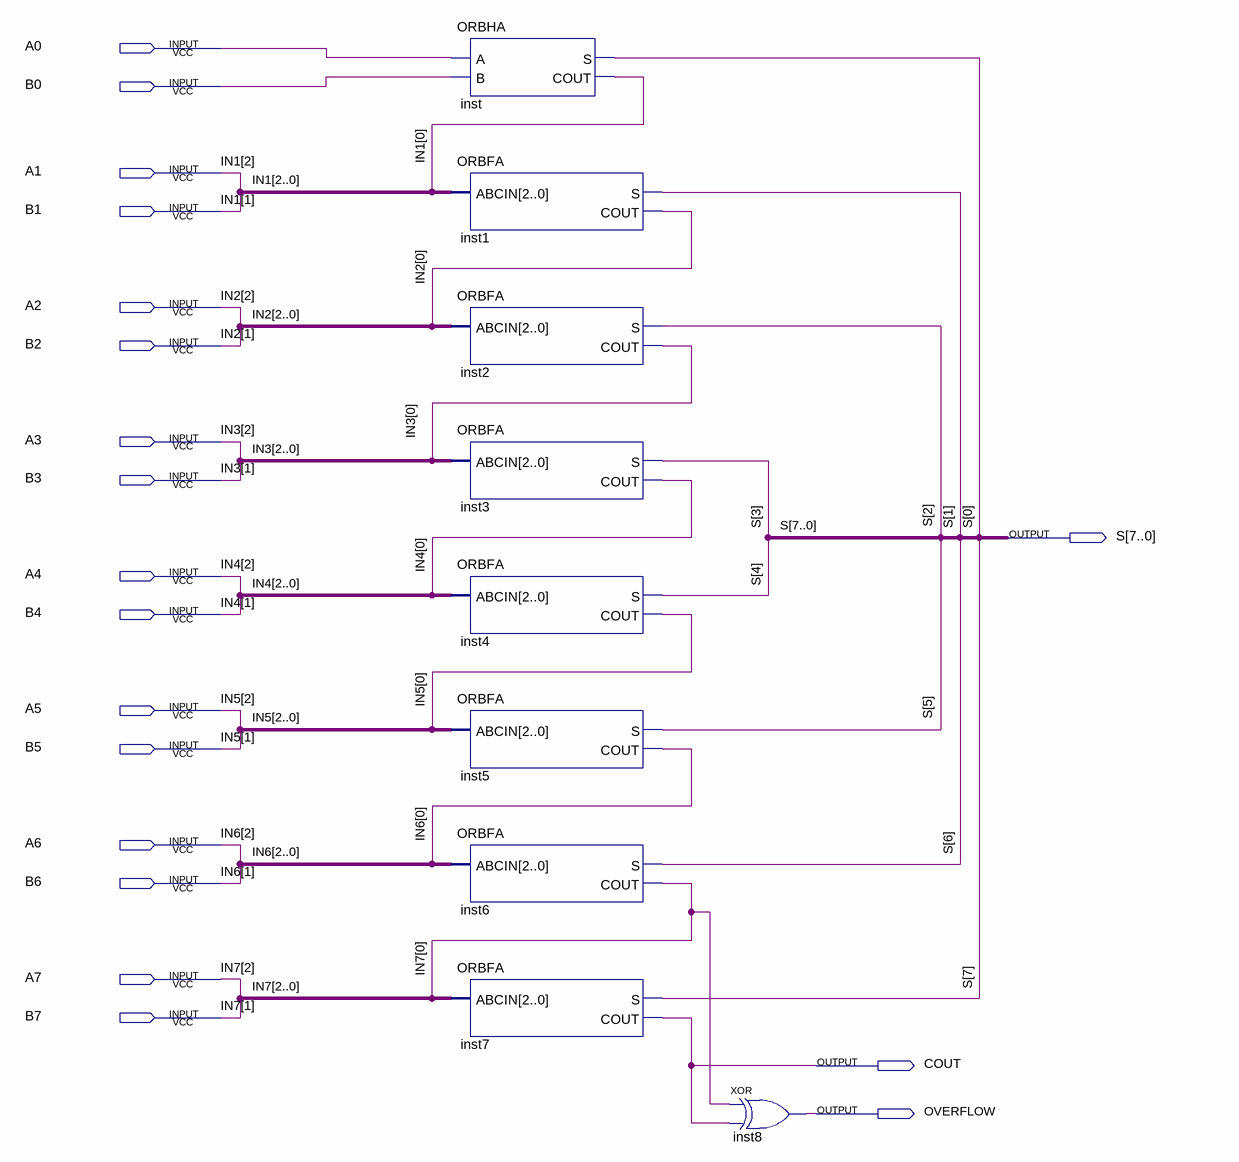
[diagram p0: schematic sheet]
// Quartus schematic ORBRCA8.bdf as structural Verilog: 9 symbols, 19 pins
module ORBRCA8 (
  input  A0,
  input  B0,
  input  A1,
  input  B1,
  input  A2,
  input  B2,
  input  A3,
  input  B3,
  input  A4,
  input  B4,
  input  A5,
  input  B5,
  input  A6,
  input  B6,
  input  A7,
  input  B7,
  output [7:0] S,
  output COUT,
  output OVERFLOW
);

  wire [0:0] IN1, IN2, IN3, IN4, IN5, IN6, IN7;

  ORBHA inst (.A(A0), .B(B0), .S(S[0]), .COUT(IN1[0]));
  ORBFA inst1 (.ABCIN({A1, B1, IN1[0]}), .S(S[1]), .COUT(IN2[0]));
  ORBFA inst2 (.ABCIN({A2, B2, IN2[0]}), .S(S[2]), .COUT(IN3[0]));
  ORBFA inst3 (.ABCIN({A3, B3, IN3[0]}), .S(S[3]), .COUT(IN4[0]));
  ORBFA inst4 (.ABCIN({A4, B4, IN4[0]}), .S(S[4]), .COUT(IN5[0]));
  ORBFA inst5 (.ABCIN({A5, B5, IN5[0]}), .S(S[5]), .COUT(IN6[0]));
  ORBFA inst6 (.ABCIN({A6, B6, IN6[0]}), .S(S[6]), .COUT(IN7[0]));
  ORBFA inst7 (.ABCIN({A7, B7, IN7[0]}), .S(S[7]), .COUT(COUT));
  xor inst8 (OVERFLOW, IN7[0], COUT);

  // Other names for the same wires on the sheet: IN1[2:1] = {A1, B1}; IN2[2:1] = {A2, B2}; IN3[2:1] = {A3, B3};
  //   IN4[2:1] = {A4, B4}; IN5[2:1] = {A5, B5}; IN6[2:1] = {A6, B6}; IN7[2:1] = {A7, B7}
endmodule
